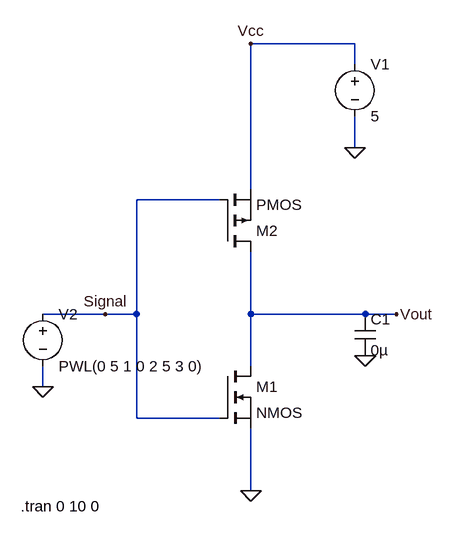
[diagram p0: schematic My First Inverter.asc]
My First Inverter.asc, the LTspice schematic file:
Version 4
SHEET 1 880 680
WIRE 400 -384 240 -384
WIRE 400 -352 400 -384
WIRE 400 -224 400 -272
WIRE 240 -160 240 -384
WIRE 192 -144 64 -144
WIRE 16 32 -80 32
WIRE 64 32 64 -144
WIRE 64 32 16 32
WIRE 240 32 240 -64
WIRE 416 32 240 32
WIRE 464 32 416 32
WIRE 240 112 240 32
WIRE -80 144 -80 112
WIRE 64 192 64 32
WIRE 192 192 64 192
WIRE 240 304 240 208
FLAG 240 304 0
FLAG 400 -224 0
FLAG -80 144 0
FLAG 416 96 0
FLAG 464 32 Vout
FLAG 240 -384 Vcc
FLAG 16 32 Signal
SYMBOL nmos 192 112 R0
SYMATTR InstName M1
SYMBOL pmos 192 -64 M180
SYMATTR InstName M2
SYMBOL voltage 400 -368 R0
WINDOW 123 0 0 Left 0
WINDOW 39 0 0 Left 0
SYMATTR InstName V1
SYMATTR Value 5
SYMBOL voltage -80 16 R0
WINDOW 123 0 0 Left 0
WINDOW 39 0 0 Left 0
SYMATTR InstName V2
SYMATTR Value PWL(0 5 1 0 2 5 3 0)
SYMBOL cap 400 32 R0
SYMATTR InstName C1
SYMATTR Value 0µ
TEXT -114 328 Left 2 !.tran 0 10 0

The netlist it stands for:
* My First Inverter.asc
M1 Vout Signal 0 0 NMOS
M2 Vout Signal Vcc Vcc PMOS
V1 Vcc 0 5
V2 Signal 0 PWL(0 5 1 0 2 5 3 0)
C1 Vout 0 0µ
.model NMOS NMOS
.model PMOS PMOS
.lib standard.mos
.tran 0 10 0
.backanno
.end